# Altium schematic sheet MainBoard_V100_SD.SchDoc
size A4; SheetNumber: 14; SheetTotal: 19; Title_: SD Card Connector
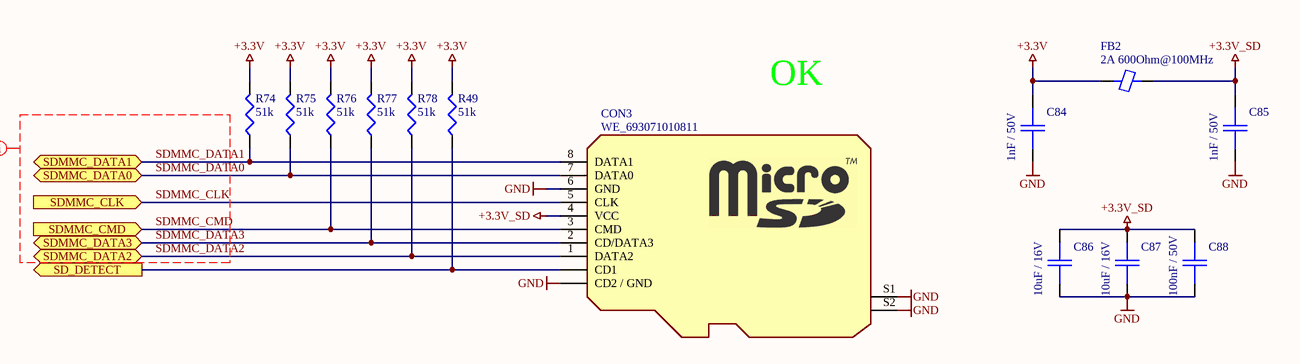
[diagram p0: MainBoard_V100_SD.SchDoc]

## Parts
C84  1nF / 50V  [0805_C]
C85  1nF / 50V  [0805_C]
C86  10uF / 16V  [0805_C]
C87  10uF / 16V  [0805_C]
C88  100nF / 50V  [0805_C]
CON3  WE_693071010811  [T_Wurth_693071010811]
FB2  2A 600Ohm@100MHz  [0805_FB]
R49  51k  [0805]
R74  51k  [0805]
R75  51k  [0805]
R76  51k  [0805]
R77  51k  [0805]
R78  51k  [0805]

## Ports
SD_DETECT (out), SDMMC_CLK (in), SDMMC_CMD (in), SDMMC_DATA0 (bidir), SDMMC_DATA1 (bidir), SDMMC_DATA2 (bidir), SDMMC_DATA3 (bidir)

## Nets
+3.3V: C84.1 FB2.1 R49.2 R74.2 R75.2 R76.2 R77.2 R78.2
+3.3V_SD: C85.1 C86.2 C87.2 C88.1 CON3.4(VCC) FB2.2
GND: C84.2 C85.2 C86.1 C87.1 C88.2 CON3.6(GND) CON3.CD2(CD2_/_GND) CON3.S1(S) CON3.S2(S)
SD_DETECT: CON3.CD1 R49.1 ; port SD_DETECT
SDMMC_CLK: CON3.5(CLK) ; port SDMMC_CLK
SDMMC_CMD: CON3.3(CMD) R76.1 ; port SDMMC_CMD
SDMMC_DATA0: CON3.7(DATA0) R75.1 ; port SDMMC_DATA0
SDMMC_DATA1: CON3.8(DATA1) R74.1 ; port SDMMC_DATA1
SDMMC_DATA2: CON3.1(DATA2) R78.1 ; port SDMMC_DATA2
SDMMC_DATA3: CON3.2(CD/DATA3) R77.1 ; port SDMMC_DATA3

## Layout directives
net class SD_MMC: SDMMC_CLK, SDMMC_CMD, SDMMC_DATA0, SDMMC_DATA1, SDMMC_DATA2, SDMMC_DATA3

## Notes on the sheet
- OK
- Board:
- Author:
- Title:
- Project:
- SVN:
- Version:
- Sheet:
- of
- Contact:
- Modified:
- Size:
- A4

## Library data of the parts
C84 C85 = 144: 1nF 50V X7R; Part Number: SMD0805-1nF-50V; Azonosító: 144; Category: Passives; Subcategory: PASS_Capacitor; Supplier 1: HESTORE; Supplier 1 order number: 100.200.70
C86 C87 = 153: 10uF 16V X5R; Part Number: SMD0805-10uF-16V; Azonosító: 153; Category: Passives; Subcategory: PASS_Capacitor; Supplier 1: HESTORE; Supplier 1 order number: 100.344.52
C88 = 149: 100nF 50V X7R; Part Number: SMD0805-100nF-50V; Azonosító: 149; Category: Passives; Subcategory: PASS_Capacitor; Supplier 1: HESTORE; Supplier 1 order number: 100.011.22
CON3 = 373: Memory Card Connectors WR-CRD SD Micro Card 8Pin Push & Push; Order Number: 2081363; Azonosító: 373; Supplier: FARNELL; Part Number: WE_693071010811; Category: Connectors; Subcategory: ELME_Other; Supplier 1: MOUSER; Supplier 1 order number: 710-693071010811; Supplier 2: HESTORE; Supplier 2 order number: 100.266.30
FB2 = 183: Ferrite bead 2A 600Ohm@100MHz; Part Number: LCBB-601 SMD; Azonosító: 183; Category: Passives; Subcategory: PASS_Other; Supplier 1: HESTORE; Supplier 1 order number: 100.327.86
R49 R74-R78 = 64: 51k 0805 0.125W 5%; Part Number: SMD0805-51k 5%; Azonosító: 64; Category: Passives; Subcategory: PASS_Resistor; Supplier 1: HESTORE; Supplier 1 order number: 100.201.72